# Altium schematic sheet 105358-3SC001-02_CPU_BRD.SchDoc: CPU Board
size 420 x 297 mm; DrawnBy: JeSa , KaKa; Organization: Hotswap Norden AB; Address1: Knarrarnäsgatan 7; Address2: SE-164 40 Kista; Address3: Sweden; DocumentNumber: 105358-3SC001-02; SheetNumber: 4; SheetTotal: 5; PageSetup: Record=PageOptions|CenterHorizontal=True|CenterVertical=True|PrintScale=0.96|XCorrection=1.00|YCorrection=1.00|PrintKind=0|BorderSize=5000000|LeftOffset=0|BottomOffset=0|Orientation=2|PaperLength=1000|PaperWidth=1000|Scale=100|PaperSource=7|PrintQuality=-4|MediaType=1|DitherType=10|PaperKind=A3|PrintScaleMode=1
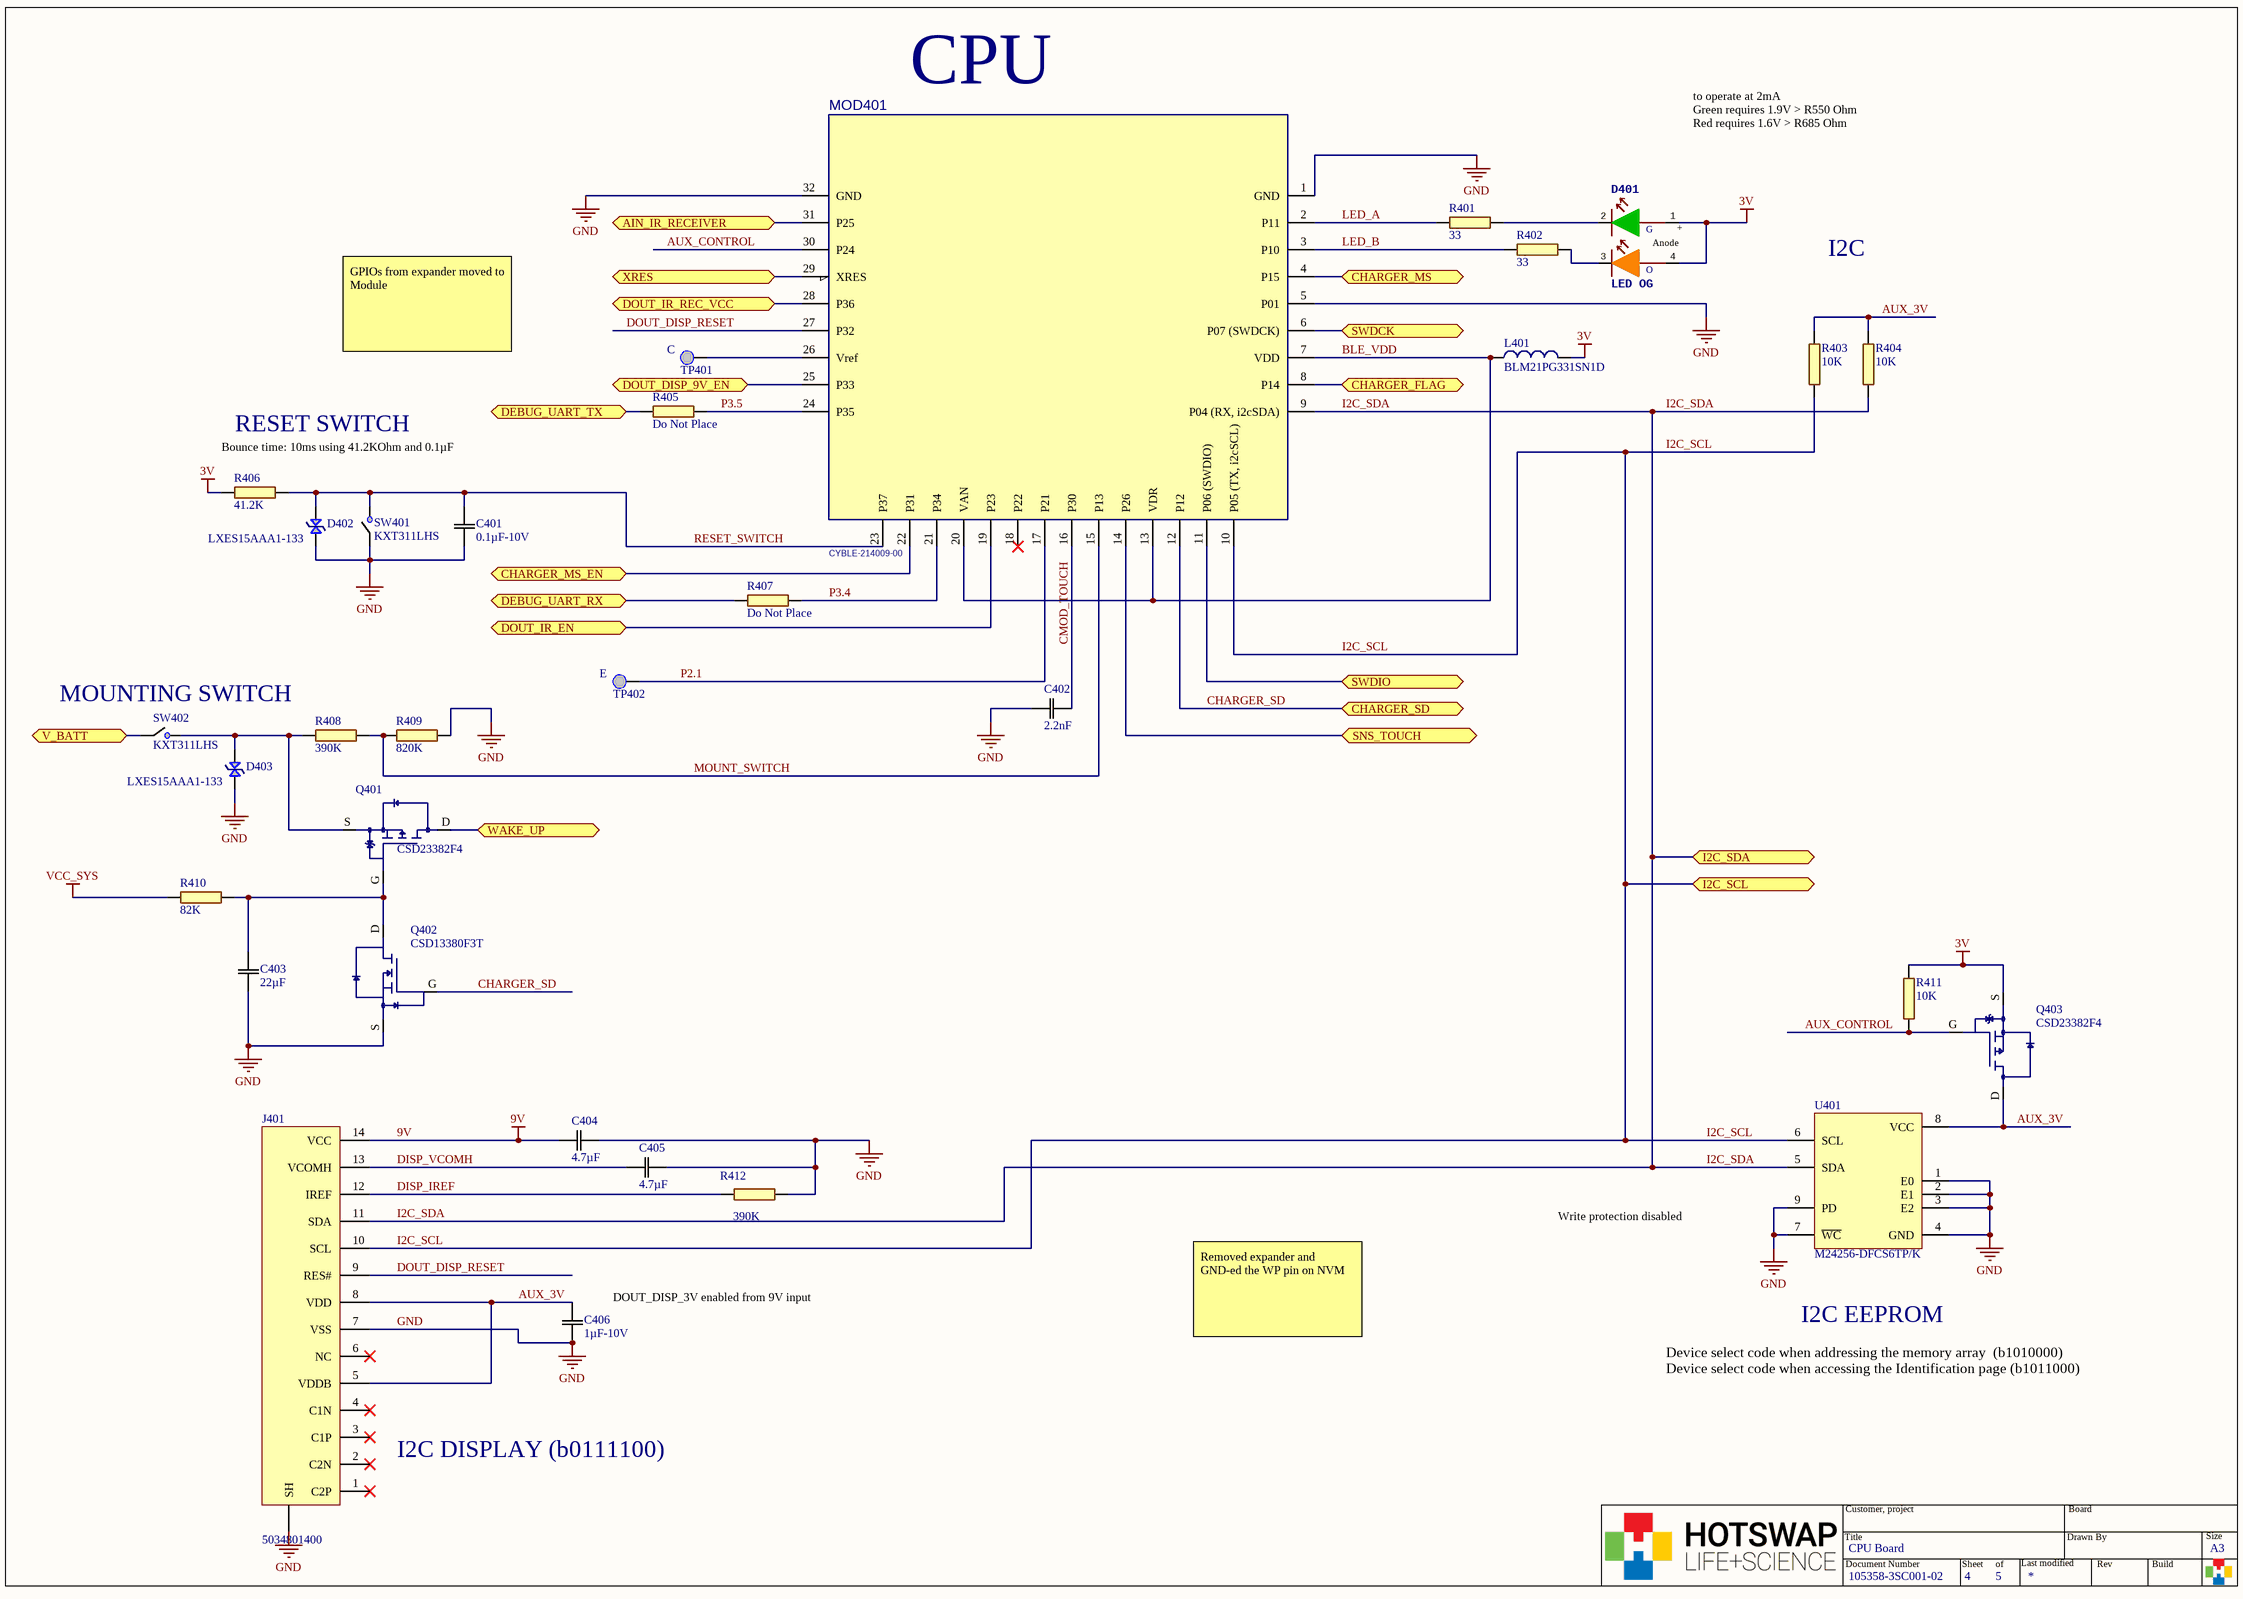
[diagram p0: 105358-3SC001-02_CPU_BRD.SchDoc]

## Parts
C401  0.1µF-10V  [0402C_HIGH_DENSITY]
C402  2.2nF  [0402C_HIGH_DENSITY]
C403  22µF  [0603C-GENERIC]
C404  4.7µF  [0402C_HIGH_DENSITY]
C405  4.7µF  [0402C_HIGH_DENSITY]
C406  1µF-10V  [0402C_HIGH_DENSITY]
D401  LED OG  [KPHBM-2012CGKSEKC]
D402  LXES15AAA1-133  [0402C-GENERIC]
D403  LXES15AAA1-133  [0402C-GENERIC]
J401  5034801400  [5034801400]  (no BOM)
L401  BLM21PG331SN1D  [0805L_HIGH_DENSITY - Hybrid 0402]
MOD401  CYBLE-214009-00  [CYBLE-014008-00_MinKeepOut]
Q401  CSD23382F4  [CSD23382F4 -DFN65P100X35-3L]
Q402  CSD13380F3T  [CSD13380F3-DFN40P69X35-3L]
Q403  CSD23382F4  [CSD23382F4 -DFN65P100X35-3L]
R401  33  [0402R-GENERIC]
R402  33  [0402R-GENERIC]
R403  10K  [0402R-GENERIC]
R404  10K  [0402R-GENERIC]
R405  Do Not Place  [0402R-GENERIC]
R406  41.2K  [0402R-GENERIC]
R407  Do Not Place  [0402R-GENERIC]
R408  390K  [0402R-GENERIC]
R409  820K  [0402R-GENERIC]
R410  82K  [0402R-GENERIC]
R411  10K  [0402R-GENERIC]
R412  390K  [0402R-GENERIC]
SW401  KXT311LHS  [KXT311LHS_B]
SW402  KXT311LHS  [KXT311LHS_B]
TP401  TEST POINT  [PAD TEST POINT]  (value not drawn)  (no BOM)
TP402  TEST POINT  [PAD TEST POINT]  (value not drawn)  (no BOM)
U401  M24256-DFCS6TP/K  [UFDFPN8-M24256-DFMC6TG]

## Ports
AIN_IR_RECEIVER, CHARGER_FLAG, CHARGER_MS, CHARGER_MS_EN, CHARGER_SD, DEBUG_UART_RX, DEBUG_UART_TX, DOUT_DISP_9V_EN, DOUT_IR_EN, DOUT_IR_REC_VCC, I2C_SCL, I2C_SDA, SNS_TOUCH, SWDCK, SWDIO, V_BATT, WAKE_UP, XRES

## Nets
3V: D401.1 D401.4 L401.2 Q403.S R406.1 R411.1
9V: C404.1 J401.14(VCC)
GND: C401.1 C402.2 C403.1 C404.2 C405.1 C406.1 D402.1 D403.1 J401.7(VSS) J401.SH MOD401.1(GND) MOD401.5(P01) MOD401.32(GND) Q402.S R409.1 R412.2 SW401.1 U401.1(E0) U401.2(E1) U401.3(E2) U401.4(GND) U401.7(~{WC}) U401.9(PD)
VCC_SYS: R410.1
AIN_IR_RECEIVER: MOD401.31(P25) ; port AIN_IR_RECEIVER
AUX_3V: C406.2 J401.5(VDDB) J401.8(VDD) Q403.D R403.1 R404.1 U401.8(VCC)
AUX_CONTROL: MOD401.30(P24) Q403.G R411.2
BLE_VDD: L401.1 MOD401.7(VDD) MOD401.13(VDR) MOD401.20(VAN)
CHARGER_FLAG: MOD401.8(P14) ; port CHARGER_FLAG
CHARGER_MS: MOD401.4(P15) ; port CHARGER_MS
CHARGER_MS_EN: MOD401.22(P31) ; port CHARGER_MS_EN
CHARGER_SD: MOD401.12(P12) Q402.G ; port CHARGER_SD
CMOD_TOUCH: C402.1 MOD401.16(P30)
DEBUG_UART_RX: R407.1 ; port DEBUG_UART_RX
DEBUG_UART_TX: R405.1 ; port DEBUG_UART_TX
DISP_IREF: J401.12(IREF) R412.1
DISP_VCOMH: C405.2 J401.13(VCOMH)
DOUT_DISP_9V_EN: MOD401.25(P33) ; port DOUT_DISP_9V_EN
DOUT_DISP_RESET: J401.9(RES#) MOD401.27(P32)
DOUT_IR_EN: MOD401.19(P23) ; port DOUT_IR_EN
DOUT_IR_REC_VCC: MOD401.28(P36) ; port DOUT_IR_REC_VCC
I2C_SCL: J401.10(SCL) MOD401.10(P05_(TX,_i2cSCL)) R403.2 U401.6(SCL) ; port I2C_SCL
I2C_SDA: J401.11(SDA) MOD401.9(P04_(RX,_i2cSDA)) R404.2 U401.5(SDA) ; port I2C_SDA
LED_A: MOD401.2(P11) R401.1
LED_B: MOD401.3(P10) R402.1
MOUNT_SWITCH: MOD401.15(P13) R408.2 R409.2
P2.1: MOD401.17(P21) TP402.1(Test_Point)
P3.4: MOD401.21(P34) R407.2
P3.5: MOD401.24(P35) R405.2
RESET_SWITCH: C401.2 D402.2 MOD401.23(P37) R406.2 SW401.2
SNS_TOUCH: MOD401.14(P26) ; port SNS_TOUCH
SWDCK: MOD401.6(P07_(SWDCK)) ; port SWDCK
SWDIO: MOD401.11(P06_(SWDIO)) ; port SWDIO
V_BATT: SW402.1 ; port V_BATT
WAKE_UP: Q401.D ; port WAKE_UP
XRES: MOD401.29(XRES) ; port XRES
NetC403_2: C403.2 Q401.G Q402.D R410.2
NetD401_2: D401.2(G) R401.2
NetD401_3: D401.3 R402.2
NetD403_2: D403.2 Q401.S R408.1 SW402.2
NetMOD401_26: MOD401.26(Vref) TP401.1(Test_Point)

Not connected (* = marked no-connect by the designer): J401 1(C2P)* 2(C2N)* 3(C1P)* 4(C1N)* 6(NC)*; MOD401 18(P22)*

## Notes on the sheet
- CPU
- to operate at 2mA
  Green requires 1.9V > R550 Ohm
  Red requires 1.6V > R685 Ohm
- I2C
- GPIOs from expander moved to Module
- (near TP401) C
- (near R406) Bounce time: 10ms using 41.2KOhm and 0.1µF
- RESET SWITCH
- (near SW402) MOUNTING SWITCH
- (near TP402) E
- Write protection disabled
- (near C406) DOUT_DISP_3V enabled from 9V input
- Removed expander and GND-ed the WP pin on NVM
- I2C EEPROM
- Device select code when addressing the memory array  (b1010000)
  Device select code when accessing the Identification page (b1011000)
- I2C DISPLAY (b0111100)
- Title
- Customer, project
- Drawn By
- Board
- Size
- Document Number
- Sheet
- of
- Last modified
- Rev
- Build
- A3
- (in symbol LED GRN/ORNG 570NM 601NM) +; Anode; O

## Library data of the parts
C401 = 0402C-0.1uF-10V: 0.1µF ±10% 10V X5R Ceramic Capacitor 0402; Manufacturer Part Number: CC0402KRX5R6BB104; Manufacturer: Yageo; Capacitance: 0.1µF; Digi-Key Part Number: 311-1336-1-ND; PackageReference: 0402; Temperature Coefficient: X5R; Tolerance: 10%; Voltage - Rated: 10V
C402 = 0402C-2.2nF-50V: 2.2nF ±10% 50V X5R Ceramic Capacitor 0402; Manufacturer Part Number: GRM155R61H222KA01D; Manufacturer: Murata Electronics North America; Capacitance: 2.2nF; Digi-Key Part Number: 490-8257-1-ND; PackageReference: 0402; Temperature Coefficient: X5R; Tolerance: 10%; Voltage - Rated: 50V
C403 = 0603C-22uF-10V: 22µF ±20% 10V Ceramic Capacitor X5R 0603; Manufacturer Part Number: C1608X5R1A226M080AC; Manufacturer: TDK Corporation; Capacitance: 22µF; Digi-Key Part Number: 445-9077-2-ND; PackageReference: 0603; Temperature Coefficient: X5R; Tolerance: 20%; Voltage - Rated: 10V
C404 C405 = 0402C-4.7uF-6.3V: 4.7µF ±10% 6.3V X5R Ceramic Capacitor 0402; Manufacturer Part Number: C1005X5R0J475K050BC; Manufacturer: TDK Corporation; Capacitance: 4.7µF; Digi-Key Part Number: 445-5947-1-ND; PackageReference: 0402; Temperature Coefficient: X5R; Tolerance: 10%; Voltage - Rated: 6.3V
C406 = 0402C-1uF-10V: 1µF ±10% 10V X5R Ceramic Capacitor 0402; Manufacturer Part Number: CC0402KRX5R6BB105; Manufacturer: Yageo; Capacitance: 1µF; Digi-Key Part Number: 311-1439-1-ND; PackageReference: 0402; Temperature Coefficient: X5R; Tolerance: 10%; Voltage - Rated: 10V
D401 = LED GRN/ORNG 570NM 601NM: LED GRN/ORNG; Manufacturer: Kingbright; Color: Green, orange; Voltage - Forward (Vf) (Typ): O 2.1V, G 2.1V; Current - Test: O 30mA, G 30mA; Wavelength - Peak: O 601nm, G 570nm; Millicandela Rating: O 250mcd, G 80mcd; Manufacturer Part Number: KPHBM-2012CGKSEKC; ComponentLink1Description: Datasheet; ComponentLink1URL: http://www.kingbright.com/attachments/file/psearch/000/00/00/KPHBM-2012CGKSEKC(Ver.11A).pdf; Digi-Key Part Number: 1686080
D402 D403 = TVS DIODE 15VWM 0402: Manufacturer: Murata Electronics North America; Type: Zener; Capacitance @ Frequency: 0.05pF @ 1MHz; Voltage - Reverse Standoff (Typ): 15V; Manufacturer Part Number: LXES15AAA1-133; Digi-Key Part Number: 490-13209-1-ND; PackageReference: 0402
J401 = Molex-5034801400: Connector molex to OLED Display; Manufacturer: Molex, LLC; Number of Positions: 14; Pitch: 0.020" (0.50mm); Flat Flex Type: FFC, FPC; FFC, FCB Thickness: 0.30mm; Mating Cycles: 10; Manufacturer Part Number: 5034801400; Digi-Key Part Number: WM1442CT-ND; ComponentLink1Description: Datasheet; ComponentLink1URL: http://www.molex.com/pdm_docs/sd/5034801400_sd.pdf; Contact Finish: Gold; ClassName: 3D_EXPORT
L401 = BLM21PG331SN1D: 0805 Ferrite Bead 330Ohm@100MHz; Manufacturer: Murata Electronics North America; Number of Lines: 1; Current Rating (Max): 1.5A; Filter Type: Power Line; DC Resistance (DCR) (Max): 70 mOhm; Digi-Key Part Number: 490-5988-1-ND; Manufacturer Part Number: BLM21PG331SN1D; ComponentLink1Description: Datasheet; ComponentLink1URL: http://www.murata.com/en-global/products/productdata/8796733767710/S0580E.pdf; PackageReference: 0805 (2012 Metric); Impedance @ FRequency: 330 Ohm @ 100MHz
MOD401 = CYBLE-214009-00: BLE PSoC Module 4.1; Manufacturer: Cypress Semiconductor Corp; Protocol: Bluetooth v4.1; Frequency: 2.4GHz; Data Rate: 1Mbps; Power - Output: 3dBm; Sensitivity: -91dBm; Voltage - Supply: 1.7 V ~ 5.5 V; Current - Receiving: 16.4mA; Current - Transmitting: 15.6mA; Supplier 1: Digi-Key; Supplier Part Number 1: 428-3809-ND; ComponentLink1URL: http://www.cypress.com/file/223701/download; ComponentLink1Description: Datasheet; Manufacturer Part Number: CYBLE-214009-00; Digi-Key Part Number: 428-3809-ND; ClassName: 3D_EXPORT
Q401 Q403 = CSD23382F4: MOSFET P-CH 12V 22A 3PICOSTAR; Manufacturer: Texas Instruments; FET Type: P-Channel; Digi-Key Part Number: 296-40003-1-ND; Manufacturer Part Number: CSD23382F4; Package / Case: 3-XFDFN; ComponentLink1Description: Datasheet; ComponentLink1URL: http://www.ti.com/lit/ds/symlink/csd23382f4.pdf
Q402 = CSD13380F3T: 12V N-CHANNEL FEMTOFET MOSFET; Manufacturer: Texas Instruments; Digi-Key Part Number: CSD13380F3T; Manufacturer Part Number: CSD13380F3T; FET Type: N-Channel; Package / Case: 3-XFDFN; ComponentLink1Description: Datasheet; ComponentLink1URL: http://www.ti.com/lit/ds/symlink/csd13380f3.pdf
R401 R402 = 0402R- 33 OHM-1%-0.063W: RES SMD  33 OHM 1% 1/16W 0402; Manufacturer: Yageo; Manufacturer Part Number: RC0402FR-0733RL; Resistance (Ohms): 33Ohm; Power: 0.063W; GENERIC_OK: YES; Digi-Key Part Number: 311-33.0LRCT-ND; Tolerance: 1%; PackageReference: 0402; Features: Moisture Resistant
R403 R404 R411 = 0402R-10k OHM-1%-0.063W: RES SMD 10kOHM 1% 1/16W 0402; Manufacturer: Yageo; Manufacturer Part Number: RC0402FR-0710KL; Power: 0.063W; GENERIC_OK: YES; Digi-Key Part Number: 311-10.0KLRCT-ND; Resistance (Ohms): 10KOhm; Tolerance: 1%; PackageReference: 0402; Features: Moisture Resistant
R405 R407 = 0402R-Do Not Place
R406 = 0402R-41.2k OHM-1%-0.063W: RES SMD 41.2kOHM 1% 1/16W 0402; Manufacturer: Yageo; Manufacturer Part Number: RC0402FR-0741K2L; Power: 0.063W; GENERIC_OK: YES; Digi-Key Part Number: YAG3155CT-ND; Resistance (Ohms): 41.2KOhm; Tolerance: 1%; PackageReference: 0402
R408 R412 = 0402R-390k OHM-1%-0.063W: RES SMD 390kOHM 1% 1/16W 0402; Manufacturer: Yageo; Manufacturer Part Number: RC0402FR-07390KL; Power: 0.063W; GENERIC_OK: YES; Digi-Key Part Number: YAG3143CT-ND; Resistance (Ohms): 390KOhm; Tolerance: 1%; PackageReference: 0402; Features: Moisture Resistant
R409 = 0402R-820k OHM-1%-0.063W: RES SMD 820kOHM 1% 1/16W 0402; Manufacturer: Yageo; Manufacturer Part Number: RC0402FR-07820KL; Power: 0.063W; GENERIC_OK: YES; Digi-Key Part Number: YAG3240CT-ND; Resistance (Ohms): 820KOhm; Tolerance: 1%; PackageReference: 0402
R410 = 0402R-82k OHM-1%-0.063W: RES SMD 82kOHM 1% 1/16W 0402; Manufacturer: Yageo; Manufacturer Part Number: RC0402FR-0782KL; Power: 0.063W; GENERIC_OK: YES; Digi-Key Part Number: 311-82.0KLRCT-ND; Resistance (Ohms): 82KOhm; Tolerance: 1%; PackageReference: 0402
SW401 SW402 = KXT311LHS: SPST Tactile Switch; Manufacturer: C&K; Contact Rating @ Voltage: 0.05A @ 12VDC; Actuator Height off PCB, Vertical: 0.60mm; Operating Force: 100gf; Mechanical Life: 300,000 Cycles; Supplier 1: Digi-Key; Supplier Part Number 1: CKN10777TR-ND; ComponentLink1URL: http://www.ckswitches.com/media/1465/kxt3.pdf; ComponentLink1Description: Datasheet; Manufacturer Part Number: KXT 311 LHS; Mounting Type: Surface Mount; Digi-Key Part Number: CKN10777CT-ND; ClassName: 3D_EXPORT
TP401 TP402 = TEST POINT: Testing Poiny; ClassName: TP
U401 = M24256-DFMC6TG: IC EEPROM 256KBIT 400KHZ 8UFDFPN; Manufacturer: STMicroelectronics; Memory Interface: I²C; Voltage - Supply: 1.7 V ~ 5.5 V; Memory Type: Non-Volatile; Clock Frequency: 1MHz; Write Cycle Time - Word, Page: 5ms; ComponentLink1URL: http://www.st.com/content/ccc/resource/technical/document/datasheet/b6/38/3e/3f/fe/a6/48/c2/CD00001891.pdf/files/CD00001891.pdf/jcr:content/translations/en.CD00001891.pdf; ComponentLink1Description: Dataseet; Manufacturer Part Number: M24256-DFMC6TG; PackageReference: 8-UFDFPN; Memory Forma: EEPROM; Digi-Key Part Number: 497-15742-1-ND